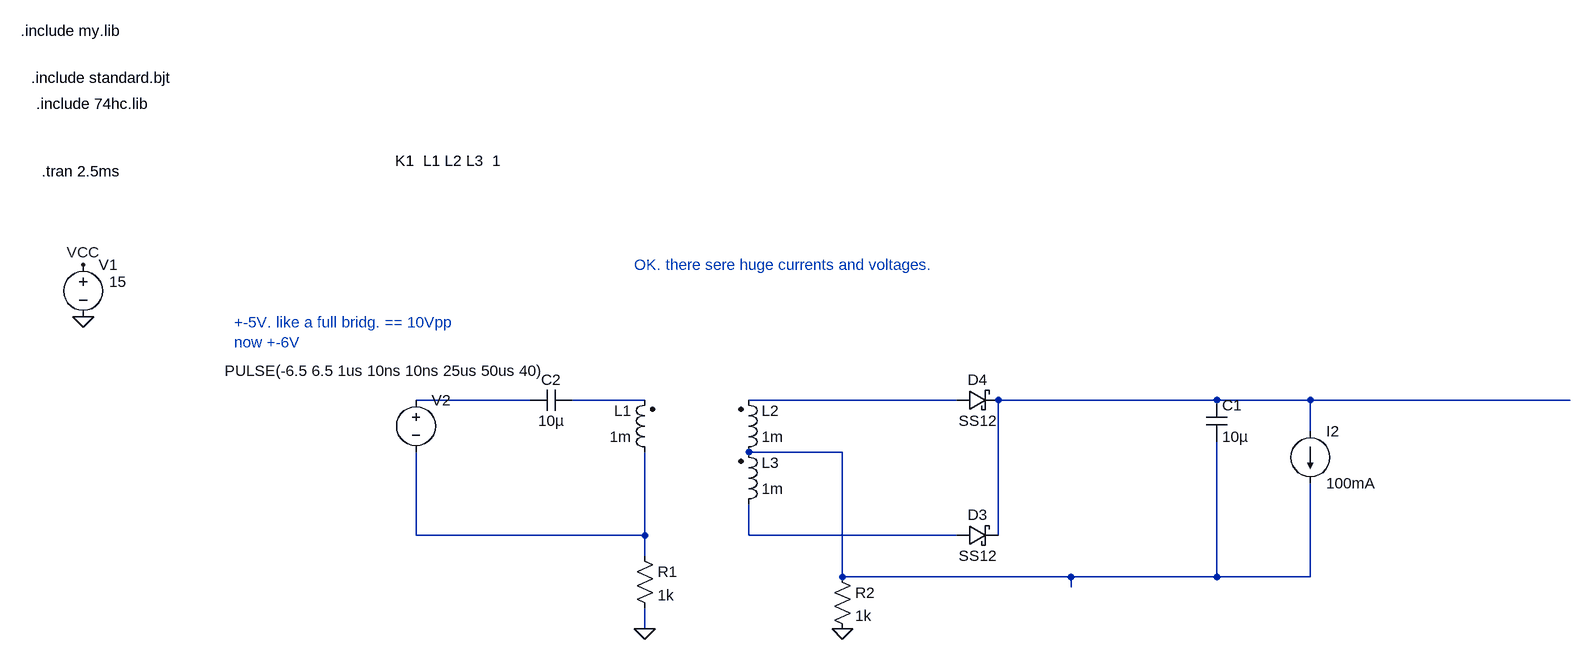
[diagram p0: schematic Draft31.asc]
Draft31.asc, the LTspice schematic file:
Version 4
SHEET 1 5720 1740
WIRE 1328 -128 1152 -128
WIRE 1504 -128 1392 -128
WIRE 1984 -128 1664 -128
WIRE 2384 -128 2048 -128
WIRE 2528 -128 2384 -128
WIRE 2928 -128 2528 -128
WIRE 2528 -80 2528 -128
WIRE 1808 -48 1664 -48
WIRE 1152 80 1152 -48
WIRE 1504 80 1504 -48
WIRE 1504 80 1152 80
WIRE 1664 80 1664 32
WIRE 1984 80 1664 80
WIRE 2048 80 2048 -128
WIRE 1504 112 1504 80
WIRE 1808 144 1808 -48
WIRE 2160 144 1808 144
WIRE 2384 144 2384 -64
WIRE 2384 144 2160 144
WIRE 2528 144 2528 0
WIRE 2528 144 2384 144
WIRE 2160 160 2160 144
WIRE 1504 224 1504 192
FLAG 640 -256 0
FLAG 640 -336 VCC
FLAG 1504 224 0
FLAG 1808 224 0
SYMBOL ind2 1648 48 M180
WINDOW 0 36 80 Left 2
WINDOW 3 36 40 Left 2
SYMATTR InstName L3
SYMATTR Value 1m
SYMATTR Type ind
SYMBOL voltage 640 -352 R0
WINDOW 123 0 0 Left 0
WINDOW 39 0 0 Left 0
WINDOW 3 40 42 Left 2
SYMATTR Value 15
SYMATTR InstName V1
SYMBOL ind2 1520 -32 R180
WINDOW 0 36 80 Left 2
WINDOW 3 36 40 Left 2
SYMATTR InstName L1
SYMATTR Value 1m
SYMATTR Type ind
SYMBOL voltage 1152 -144 R0
WINDOW 123 0 0 Left 0
WINDOW 39 0 0 Left 0
WINDOW 3 -294 -29 Left 2
SYMATTR Value PULSE(-6.5 6.5 1us 10ns 10ns 25us 50us 40)
SYMATTR InstName V2
SYMBOL ind2 1648 -32 M180
WINDOW 0 36 80 Left 2
WINDOW 3 36 40 Left 2
SYMATTR InstName L2
SYMATTR Value 1m
SYMATTR Type ind
SYMBOL cap 2368 -128 R0
SYMATTR InstName C1
SYMATTR Value 10µ
SYMBOL current 2528 -80 R0
WINDOW 123 0 0 Left 0
WINDOW 39 0 0 Left 0
SYMATTR InstName I2
SYMATTR Value 100mA
SYMBOL schottky 1984 -112 R270
WINDOW 0 32 32 VTop 2
WINDOW 3 0 32 VBottom 2
SYMATTR InstName D4
SYMATTR Value SS12
SYMATTR Description Diode
SYMATTR Type diode
SYMBOL schottky 1984 96 R270
WINDOW 0 32 32 VTop 2
WINDOW 3 0 32 VBottom 2
SYMATTR InstName D3
SYMATTR Value SS12
SYMATTR Description Diode
SYMATTR Type diode
SYMBOL res 1792 128 R0
SYMATTR InstName R2
SYMATTR Value 1k
SYMBOL cap 1392 -144 R90
WINDOW 0 0 32 VBottom 2
WINDOW 3 32 32 VTop 2
SYMATTR InstName C2
SYMATTR Value 10µ
SYMBOL res 1488 96 R0
SYMATTR InstName R1
SYMATTR Value 1k
TEXT 576 -480 Left 2 !.tran 2.5ms
TEXT 1120 -496 Left 2 !K1  L1 L2 L3  1
TEXT 560 -624 Left 2 !.include standard.bjt
TEXT 544 -696 Left 2 !.include my.lib
TEXT 568 -584 Left 2 !.include 74hc.lib
TEXT 872 -248 Left 2 ;+-5V. like a full bridg. == 10Vpp\nnow +-6V
TEXT 1488 -336 Left 2 ;OK. there sere huge currents and voltages.

The netlist it stands for:
* Draft31.asc
L3 N007 N005 1m
V1 VCC 0 15
L1 N006 N002 1m
V2 N001 N006 PULSE(-6.5 6.5 1us 10ns 10ns 25us 50us 40)
L2 N005 N003 1m
C1 N004 N005 10µ
I2 N004 N005 100mA
D4 N003 N004 SS12
D3 N007 N004 SS12
R2 N005 0 1k
C2 N002 N001 10µ
R1 N006 0 1k
.model D D
.lib standard.dio
.tran 2.5ms
K1  L1 L2 L3  1
.include standard.bjt
.include my.lib
.include 74hc.lib
* +-5V. like a full bridg. == 10Vpp
* now +-6V
* OK. there sere huge currents and voltages.
.backanno
.end